# EAGLE design Rear_fog_lamp (EAGLE 8.0.1)
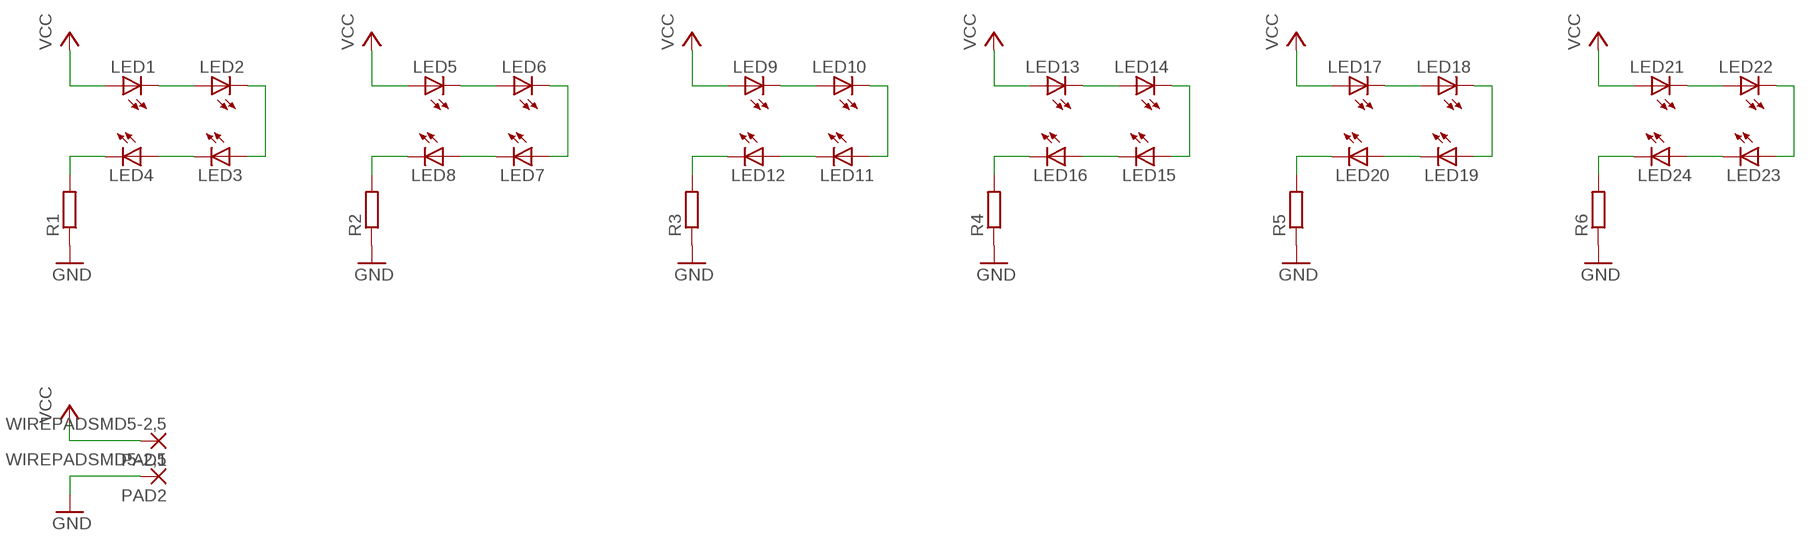
[diagram p0: schematic, sheet 1]

## Parts
LED1  LED5MM  [LED5MM]
LED2  LED5MM  [LED5MM]
LED3  LED5MM  [LED5MM]
LED4  LED5MM  [LED5MM]
LED5  LED5MM  [LED5MM]
LED6  LED5MM  [LED5MM]
LED7  LED5MM  [LED5MM]
LED8  LED5MM  [LED5MM]
LED9  LED5MM  [LED5MM]
LED10  LED5MM  [LED5MM]
LED11  LED5MM  [LED5MM]
LED12  LED5MM  [LED5MM]
LED13  LED5MM  [LED5MM]
LED14  LED5MM  [LED5MM]
LED15  LED5MM  [LED5MM]
LED16  LED5MM  [LED5MM]
LED17  LED5MM  [LED5MM]
LED18  LED5MM  [LED5MM]
LED19  LED5MM  [LED5MM]
LED20  LED5MM  [LED5MM]
LED21  LED5MM  [LED5MM]
LED22  LED5MM  [LED5MM]
LED23  LED5MM  [LED5MM]
LED24  LED5MM  [LED5MM]
PAD1  WIREPADSMD5-2,5  [5-2,5]
PAD2  WIREPADSMD5-2,5  [5-2,5]
R1  R-EU_0204/7  [0204/7]
R2  R-EU_0204/7  [0204/7]
R3  R-EU_0204/7  [0204/7]
R4  R-EU_0204/7  [0204/7]
R5  R-EU_0204/7  [0204/7]
R6  R-EU_0204/7  [0204/7]

## Nets
GND: PAD2.1(P) R1.1 R2.1 R3.1 R4.1 R5.1 R6.1
N$1: LED1.K(C) LED2.A
N$2: LED2.K(C) LED3.A
N$3: LED3.K(C) LED4.A
N$4: LED4.K(C) R1.2
N$5: LED5.K(C) LED6.A
N$6: LED6.K(C) LED7.A
N$7: LED7.K(C) LED8.A
N$8: LED8.K(C) R2.2
N$9: LED9.K(C) LED10.A
N$10: LED10.K(C) LED11.A
N$11: LED11.K(C) LED12.A
N$12: LED12.K(C) R3.2
N$13: LED13.K(C) LED14.A
N$14: LED14.K(C) LED15.A
N$15: LED15.K(C) LED16.A
N$16: LED16.K(C) R4.2
N$17: LED17.K(C) LED18.A
N$18: LED18.K(C) LED19.A
N$19: LED19.K(C) LED20.A
N$20: LED20.K(C) R5.2
N$21: LED21.K(C) LED22.A
N$22: LED22.K(C) LED23.A
N$23: LED23.K(C) LED24.A
N$24: LED24.K(C) R6.2
VCC: LED1.A LED5.A LED9.A LED13.A LED17.A LED21.A PAD1.1(P)

## Library data of the parts
LED1-LED24 = led:LED: LED OSRAM: - CHIPLED LG R971, LG N971, LY N971, LG Q971, LY Q971, LO R971, LY R971 LH N974, LH R974 LS Q976, LO Q976, LY Q976 LO Q996 - Hyper CHIPLED LW Q18S LB Q993, LB Q99A, LB R99A - SideLED LS A670, LO A670, LY A670, LG A670, LP A670 LB A673, LV A673, LT A673, LW A673 LH A674 LY A675 LS A676, LA A676, LO A676, LY A676, LW A676 LS A679, LY A679, LG A679 - Hyper Micro SIDELED® LS Y876, LA Y876, LO Y876, LY Y876 LT Y87S - SmartLED LW L88C, LW L88S LB L89C, LB L89S, LG L890 LS L89K, LO L89K, LY L89K LS L896, LA L896, LO L896, LY L896 - TOPLED LS T670, LO T670, LY T670, LG T670, LP T670 LSG T670, LSP T670, LSY T670, LOP T670, LYG T670 LG T671, LOG T671, LSG T671 LB T673, LV T673, LT T673, LW T673 LH T674 LS T676, LA T676, LO T676, LY T676, LB T676, LH T676, LSB T676, LW T676 LB T67C, LV T67C, LT T67C, LS T67K, LO T67K, LY T67K, LW E67C LS E67B, LA E67B, LO E67B, LY E67B, LB E67C, LV E67C, LT E67C LW T67C LS T679, LY T679, LG T679 LS T770, LO T770, LY T770, LG T770, LP T770 LB T773, LV T773, LT T773, LW T773 LH T774 LS E675, LA E675, LY E675, LS T675 LS T776, LA T776, LO T776, LY T776, LB T776 LHGB T686 LT T68C, LB T68C - Hyper Mini TOPLED® LB M676 - Mini TOPLED Santana® LG M470 LS M47K, LO M47K, LY M47K Source: http://www.osram.convergy.de LUXEON: - LUMILED® LXK2-PW12-R00, LXK2-PW12-S00, LXK2-PW14-U00, LXK2-PW14-V00 LXK2-PM12-R00, LXK2-PM12-S00, LXK2-PM14-U00 LXK2-PE12-Q00, LXK2-PE12-R00, LXK2-PE12-S00, LXK2-PE14-T00, LXK2-PE14-U00 LXK2-PB12-K00, LXK2-PB12-L00, LXK2-PB12-M00, LXK2-PB14-N00, LXK2-PB14-P00, LXK2-PB14-Q00 LXK2-PR12-L00, LXK2-PR12-M00, LXK2-PR14-Q00, LXK2-PR14-R00 LXK2-PD12-Q00, LXK2-PD12-R00, LXK2-PD12-S00 LXK2-PH12-R00, LXK2-PH12-S00 LXK2-PL12-P00, LXK2-PL12-Q00, LXK2-PL12-R00 Source: www.luxeon.com KINGBRIGHT: KA-3528ASYC Source: www.kingbright.com
PAD1 PAD2 = wirepad:WIREPAD: Wire PAD connect wire on PCB
R1-R6 = rcl:R-EU_: RESISTOR, European symbol

## Board
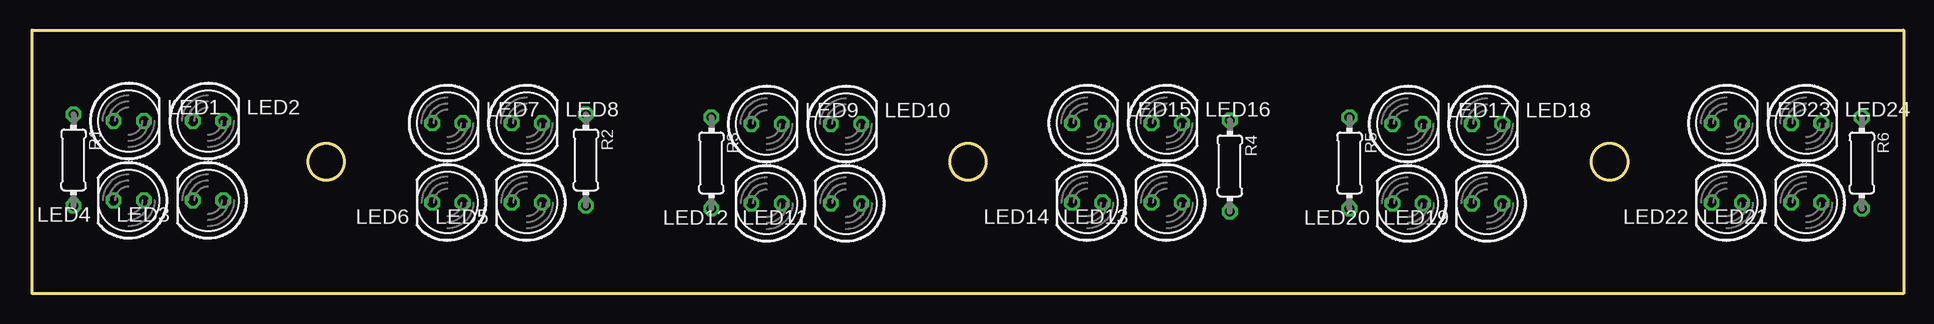
[diagram p1: board, top side]
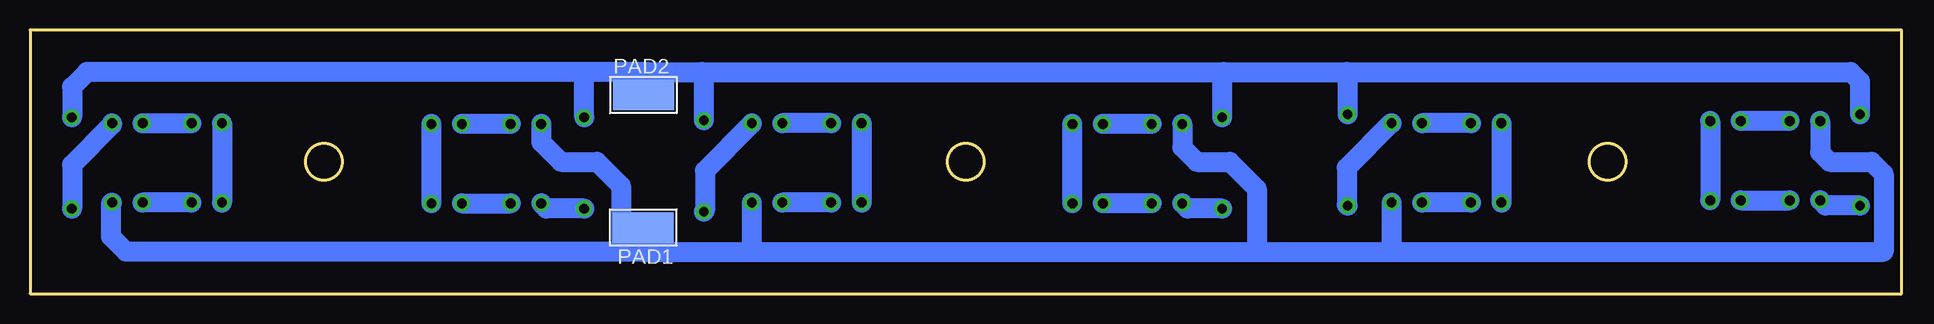
[diagram p2: board, bottom side, seen from below]

Size 156 x 22 mm. Coordinates in mm from the lower left corner, seen from the top.
Outline: 156,22 156,0 0,0 0,22 156,22
Outline: circle at 78,11 radius 1.5
Outline: circle at 131.5,11 radius 1.52
Outline: circle at 24.5,11 radius 1.5
Copper layers (1*16): Top 0.035mm / dielectric 1.5mm / Bottom 0.035mm
Design rules "default": minimum track width 10mil, minimum drill 24mil, track to track 8mil, track to pad 8mil, pad to pad 8mil, via to via 8mil, smd to smd 8mil, copper to edge 40mil, drill to drill 8mil, minimum pad ring 10mil, minimum via ring 8mil, stop-mask expansion 4mil, vias tented up to drill 0mil, thermal gap 10mil

### Footprints (pad centres in the part's own frame; a part is rotated, then mirrored left to right if it is on the bottom)
LED5MM = drill 0.813 octagon: A -1.27,0; K 1.27,0
5-2,5 = smd 2.54 x 5.08: 1 0,0
0204/7 = drill 0.813 octagon: 1 -3.81,0; 2 3.81,0

### Placement (x,y rotation side)
LED1  8.05,14.4 0 top
LED2  14.67,14.4 0 top
LED3  14.67,7.78 180 top
LED4  8.05,7.78 180 top
LED5  41.24,7.6 180 top
LED6  34.62,7.6 180 top
LED7  34.62,14.22 0 top
LED8  41.24,14.22 0 top
LED9  61.22,14.15 0 top
LED10  67.84,14.15 0 top
LED11  67.84,7.53 180 top
LED12  61.22,7.53 180 top
LED13  94.57,7.6 180 top
LED14  87.95,7.6 180 top
LED15  87.95,14.22 0 top
LED16  94.57,14.22 0 top
LED17  114.66,14.15 0 top
LED18  121.28,14.15 0 top
LED19  121.28,7.53 180 top
LED20  114.66,7.53 180 top
LED21  147.88,7.6 180 top
LED22  141.26,7.6 180 top
LED23  141.26,14.22 0 top
LED24  147.88,14.22 0 top
PAD1  104.89,5.51 90 bottom
PAD2  104.86,16.58 270 bottom
R1  3.45,11.15 270 top
R2  46.16,11.15 270 top
R3  56.62,10.9 270 top
R4  99.83,10.65 270 top
R5  109.81,10.9 270 top
R6  152.52,10.9 270 top

### Tracks (layer width: path | path; a pad name or v marks a point on that pad's centre or on a via)
GND
  Bottom 1.676: R1.1 3.45,17.7 4.25,18.5 46.25,18.5 | R6.1 152.5,14.73 152.5,17.25 151.25,18.5 109.75,18.5 | 56.5,18.5 46.25,18.5 | 100,18.5 56.5,18.5 | 104.5,18.5 109.75,18.5 | 104.5,18.5 100,18.5 | R2.1 46.16,18.41 46.25,18.5 | R3.1 56.62,18.38 56.5,18.5 | R4.1 99.83,18.33 100,18.5 | R5.1 109.81,18.44 109.75,18.5 | PAD2.1 104.86,18.14 104.5,18.5
N$1
  Bottom 1.676: LED1.K LED2.A
N$2
  Bottom 1.676: LED2.K LED3.A
N$3
  Bottom 1.676: LED3.K LED4.A
N$4
  Bottom 1.676: R1.2 6.34,7.34 LED4.K
N$5
  Bottom 1.676: LED6.A LED5.K
N$6
  Bottom 1.676: LED7.A LED6.K
N$7
  Bottom 1.676: LED7.K LED8.A
N$8
  Bottom 1.676: LED8.K 42.53,14.22 46.25,10.5 46.25,7.43 R2.2
N$9
  Bottom 1.676: LED9.K LED10.A
N$10
  Bottom 1.676: LED11.A LED10.K
N$11
  Bottom 1.676: LED12.A LED11.K
N$12
  Bottom 1.676: R3.2 59.51,7.09 LED12.K
N$13
  Bottom 1.676: LED14.A LED13.K
N$14
  Bottom 1.676: LED15.A LED14.K
N$15
  Bottom 1.676: LED15.K LED16.A
N$16
  Bottom 1.676: LED16.K 95.84,14.16 99.75,10.25 99.75,6.92 R4.2
N$17
  Bottom 1.676: LED17.K LED18.A
N$18
  Bottom 1.676: LED18.K LED19.A
N$19
  Bottom 1.676: LED19.K LED20.A
N$20
  Bottom 1.676: R5.2 112.95,7.09 LED20.K
N$21
  Bottom 1.676: LED22.A LED21.K
N$22
  Bottom 1.676: LED23.A LED22.K
N$23
  Bottom 1.676: LED24.A LED23.K
N$24
  Bottom 1.676: LED24.K 149.15,14.1 152.5,10.75 152.5,7.11 R6.2
VCC
  Bottom 1.676: LED1.A 6.78,11.78 6,11 2.5,11 1.5,10 1.5,3.5 42.25,3.5 | LED21.A 149.25,7.5 149.25,4.75 148,3.5 107,3.5 | 54,3.5 42.25,3.5 | 95.75,3.5 54,3.5 | 105,3.5 107,3.5 | 105,3.5 95.75,3.5 | LED5.A 42.51,3.76 42.25,3.5 | LED9.A 59.95,12.2 58.75,11 56,11 53.75,8.75 53.75,3.75 54,3.5 | LED13.A 95.84,3.59 95.75,3.5 | LED17.A 113.39,12.64 111.75,11 108.75,11 106.75,9 106.75,3.75 107,3.5 | PAD1.1 104.89,3.61 105,3.5